# Altium schematic sheet ADC_Filter_Cell.SchDoc
size A4
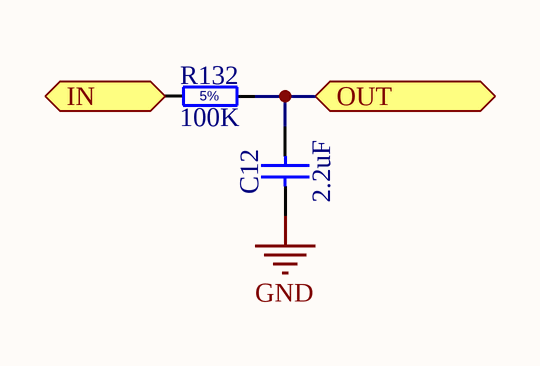
[diagram p0: ADC_Filter_Cell.SchDoc]

## Parts
C12  2.2uF  [CAPRR254-254X381X508]
R132  100K  [RES_ARCOL_RCC025]

## Ports
IN, OUT

## Nets
GND: C12.1
IN: R132.1 ; port IN
OUT: C12.2 R132.2 ; port OUT

## Notes on the sheet
- (in symbol RCF_5K1_5%_0.25W_+10-6PPM_ARCOL_RCC025) 5%

## Library data of the parts
C12 = CCR_15PF_100V_5%_COG_254-254X381X508: Non-polarised capacitor; Part Description: Radial Lead Type Multilayer Ceramic Capacitor; Manufacturer: GENERIC; Manufacturer1 Part Number: SR151A150JAR; Voltage: 100VDC; TC: COG; Tolerance: ±5%; Table: Capacitors THD; Part Number: CCR_15PF_100V_5%_COG_254-254X381X508; Component Kind: Standard; Component Type: Standard; Pin Count: 2; Value: 2.2uF; Status: None; Manufacturer Part Number: CCR_15PF_100V_5%_COG_254-254X381X508; Case: LS2.54 W2.54 x L3.81 x H5.84; Mounted: Yes; Socket: No; SMD: No; ComponentHeight: 5.08mm; Manufacturer1 Example: AVX; Manufacturer1 ComponentHeight: 5.08mm; HelpURL: \\cern.ch\dfs\Applications\Altium\Datasheets\CCR_AVX_SR15.pdf; Author: CERN DEM JLC; CreateDate: 16.12.2010; LatestRevisionDate: 16.12.2010
R132 = RCF_5K1_5%_0.25W_+10-6PPM_ARCOL_RCC025: Resistor - 5%; Part Description: Solid Carbon Resistor RCC Series; Manufacturer: ARCOL; Manufacturer Part Number: RCC025 5k1 J; Power: 0.25W; TC: +10-6ppm/°C; Table: Resistors THD; Part Number: RCF_5K1_5%_0.25W_+10-6PPM_ARCOL_RCC025; Component Kind: Standard; Component Type: Standard; Pin Count: 2; Value: 100K; Status: None; Tolerance: ±5%; Case: LS10.16 L6.3 x D2.4; Mounted: Yes; Socket: No; SMD: No; ComponentHeight: 2.5mm; HelpURL: \\cern.ch\dfs\Applications\Altium\Datasheets\RCF_ARCOL_RCC025.pdf; Author: CERN DEM JLC; CreateDate: 30.10.2013; LatestRevisionDate: 30.10.2013